# Altium schematic sheet Mechanical.SchDoc
size A4; SheetNumber: 7; SheetTotal: 8
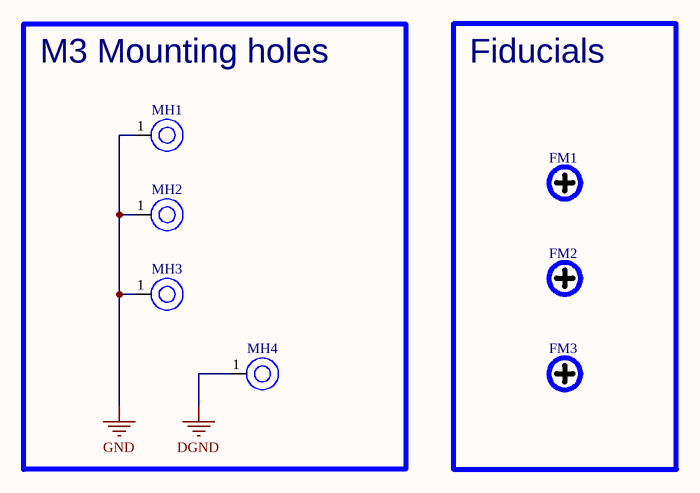
[diagram p0: Mechanical.SchDoc]

## Parts
FM1  FIDUCIAL_CROSS_1MM5  [FIDUCIAL_CROSS_1MM5]  (value not drawn)  (no BOM)
FM2  FIDUCIAL_CROSS_1MM5  [FIDUCIAL_CROSS_1MM5]  (value not drawn)  (no BOM)
FM3  FIDUCIAL_CROSS_1MM5  [FIDUCIAL_CROSS_1MM5]  (value not drawn)  (no BOM)
MH1  MTHP3P2MM  [MTHP3P2MM-Footprint-1]  (value not drawn)
MH2  MTHP3P2MM  [MTHP3P2MM-Footprint-1]  (value not drawn)
MH3  MTHP3P2MM  [MTHP3P2MM-Footprint-1]  (value not drawn)
MH4  MTHP3P2MM  [MTHP3P2MM-Footprint-1]  (value not drawn)

## Blocks framed on the sheet
M3 Mounting holes: MH1-MH4
Fiducials: FM1-FM3

## Nets
DGND: MH4.1
GND: MH1.1 MH2.1 MH3.1

## Library data of the parts
FM1-FM3 = CMP-020-000009-1: Fiducial Marker Cross 1.5mm NO BOM; Design Item ID: FIDUCIAL_CROSS_1MM5; Source: Schematic-Lib-PhilsLab.SchLib
MH1-MH4 = CMP-00028-00009-2: Mounting Hole Plated 3.2 mm drill